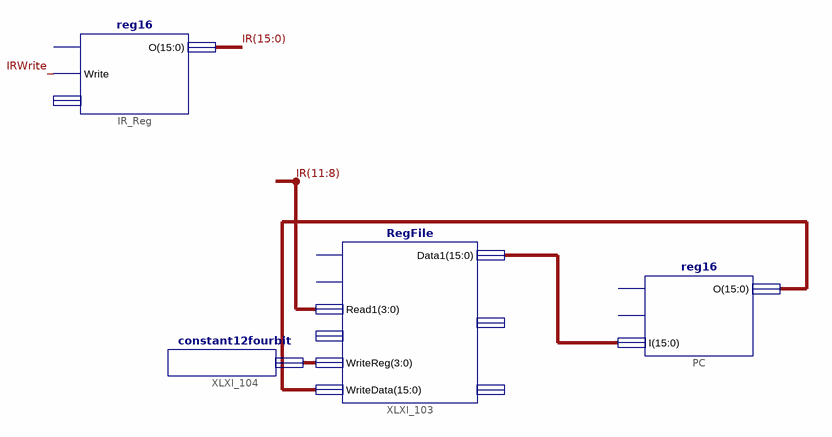
[diagram p0: schematic sheet 1]
// Xilinx ISE schematic jal.sch (spartan3adsp) as structural Verilog: 4 symbols, 0 ports
module jal (
);

  wire IRWrite;
  wire [3:0] XLXN_7;
  wire [15:0] IR, XLXN_5, XLXN_6;

  reg16 IR_Reg (.Write(IRWrite), .O(IR));  // open: CLK, I
  RegFile XLXI_103 (
    .Read1(IR[11:8]), .WriteReg(XLXN_7), .WriteData(XLXN_6), .Data1(XLXN_5));  // open: RegWrite, clock, Read2, Data2, Data3
  reg16 PC (.I(XLXN_5), .O(XLXN_6));  // open: CLK, Write
  constant12fourbit XLXI_104 (.O(XLXN_7));
endmodule
